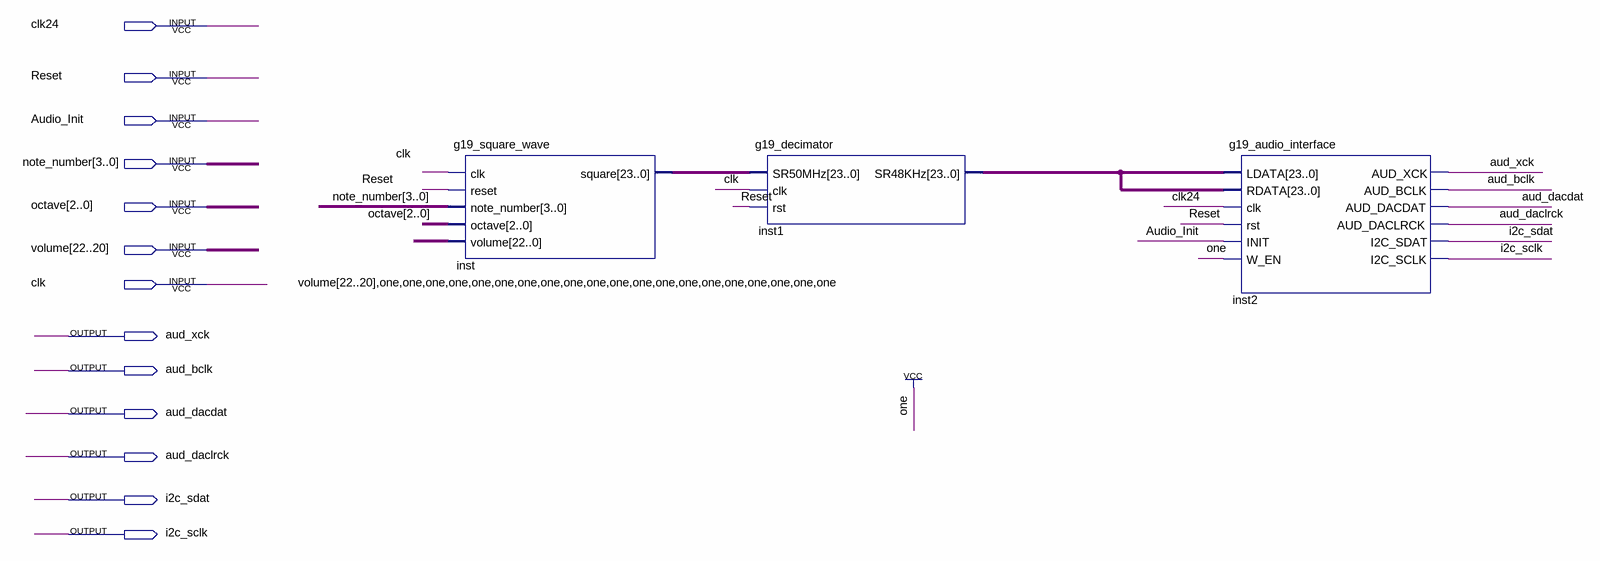
[diagram p0: schematic sheet]
// Quartus schematic g19_square_wave_generator1.bdf as structural Verilog: 3 symbols, 13 pins
module g19_square_wave_generator1 (
  input  clk24,
  input  Reset,
  input  Audio_Init,
  input  [3:0] note_number,
  input  [2:0] octave,
  input  [22:20] volume,
  input  clk,
  output aud_xck,
  output aud_bclk,
  output aud_dacdat,
  output aud_daclrck,
  output i2c_sdat,
  output i2c_sclk
);

  wire [23:0] inst1_sr48khz, inst_square;

  g19_square_wave inst (
    .clk(clk), .reset(Reset), .note_number(note_number), .octave(octave), .volume({volume, {20{1'b1}}}),
    .square(inst_square));
  g19_decimator inst1 (.SR50MHz(inst_square), .clk(clk), .rst(Reset), .SR48KHz(inst1_sr48khz));
  g19_audio_interface inst2 (
    .LDATA(inst1_sr48khz), .RDATA(inst1_sr48khz), .clk(clk24), .rst(Reset), .INIT(Audio_Init), .W_EN(1'b1),
    .AUD_XCK(aud_xck), .AUD_BCLK(aud_bclk), .AUD_DACDAT(aud_dacdat), .AUD_DACLRCK(aud_daclrck),
    .I2C_SDAT(i2c_sdat), .I2C_SCLK(i2c_sclk));
endmodule
